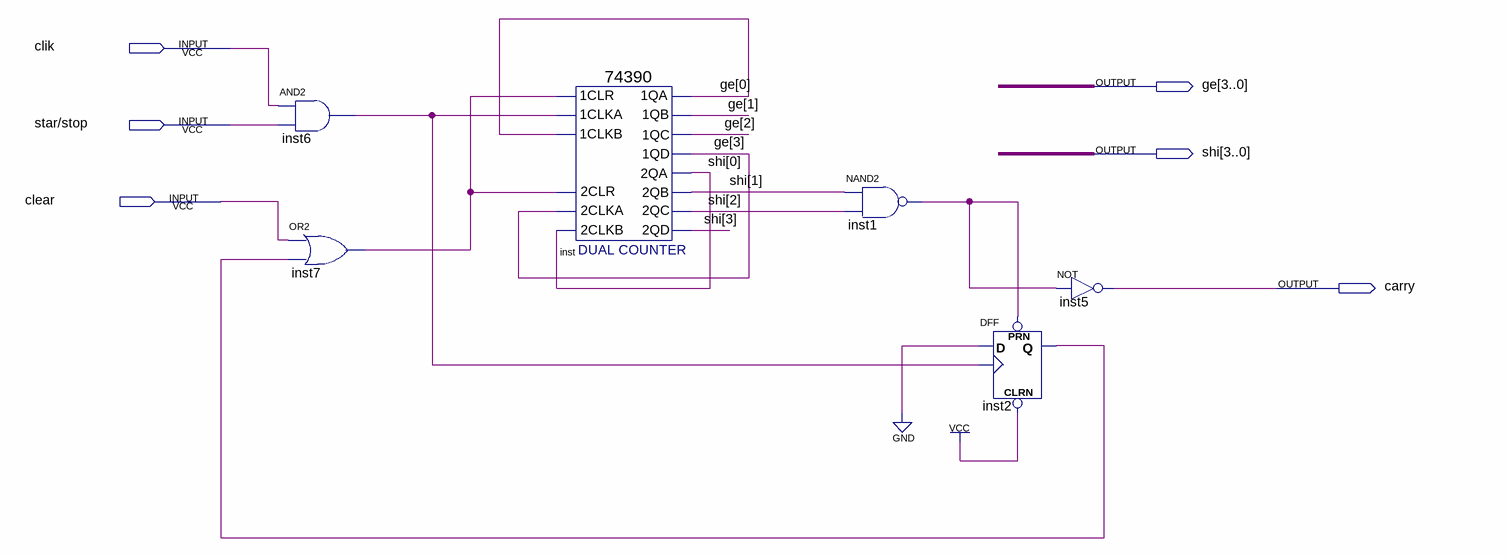
[diagram p0: schematic sheet]
// Quartus schematic cnt60.bdf as structural Verilog: 6 symbols, 6 pins
module cnt60 (
  input  clik,
  input  \star/stop ,
  input  clear,
  output [3:0] ge,
  output [3:0] shi,
  output carry
);

  wire inst1_out, inst2_q, inst6_out, inst7_out;

  and inst6 (inst6_out, clik, \star/stop );
  or inst7 (inst7_out, clear, inst2_q);
  \74390  inst (
    .\2CLKA (ge[3]), .\2CLR (inst7_out), .\2CLKB (shi[0]), .\1CLR (inst7_out), .\1CLKA (inst6_out),
    .\1CLKB (ge[0]), .\1QA (ge[0]), .\1QB (ge[1]), .\1QC (ge[2]), .\1QD (ge[3]), .\2QA (shi[0]),
    .\2QB (shi[1]), .\2QC (shi[2]), .\2QD (shi[3]));
  nand inst1 (inst1_out, shi[1], shi[2]);
  DFF inst2 (.CLRN(1'b1), .CLK(inst6_out), .D(1'b0), .PRN(inst1_out), .Q(inst2_q));
  not inst5 (carry, inst1_out);
endmodule
